# EAGLE design untitled (EAGLE 9.6.2)
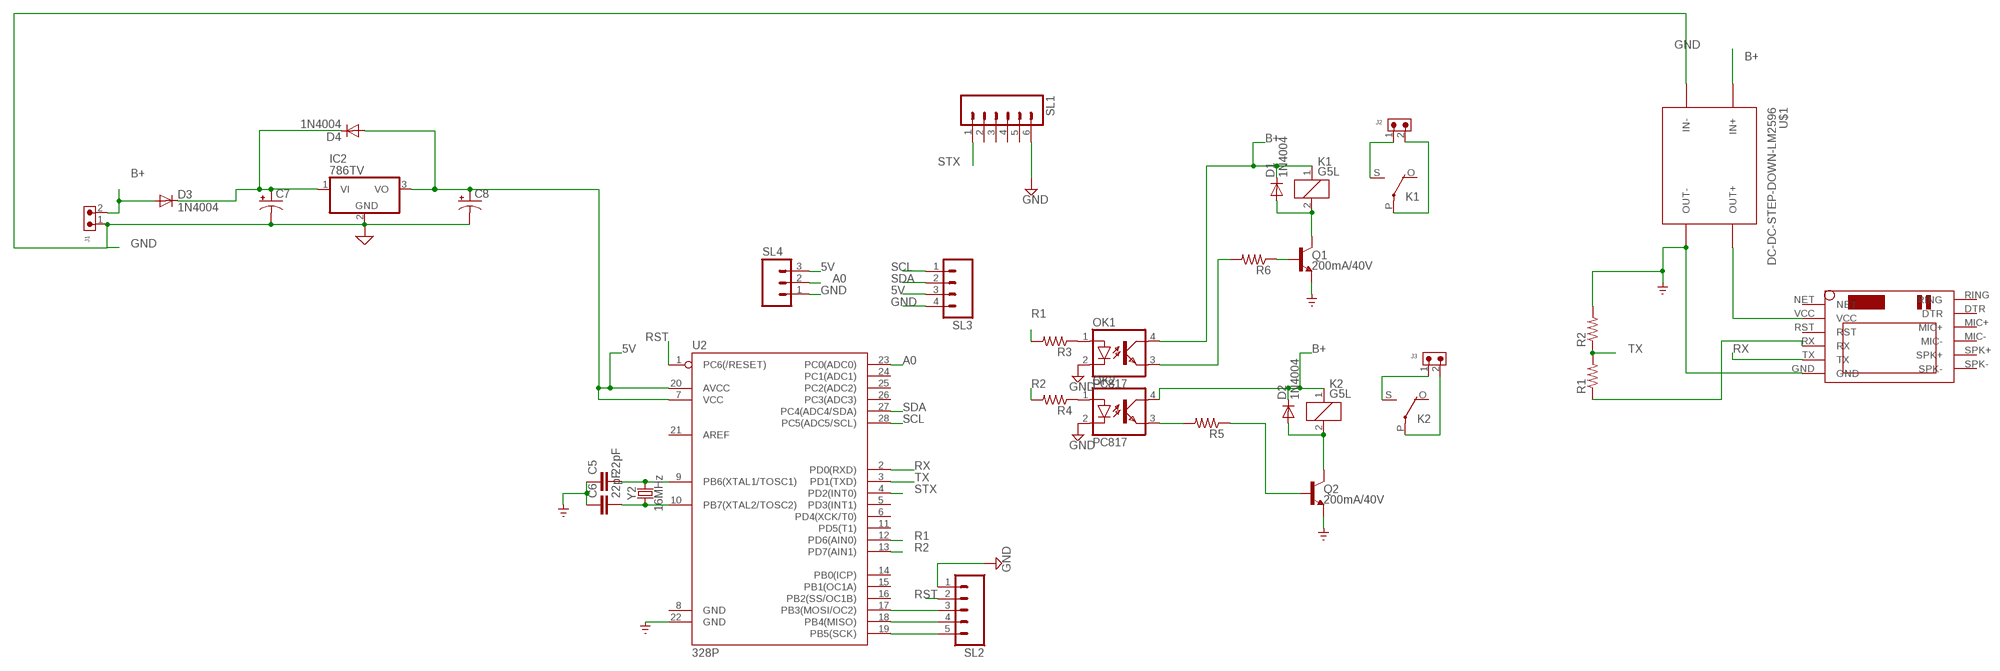
[diagram p0: schematic, sheet 1]

## Parts
C5  22pF  22PF-PTH-2.54MM-200V-5%  [CAP-PTH-2.54]
C6  22pF  22PF-PTH-2.54MM-200V-5%  [CAP-PTH-2.54]
C7  CAPACITOR-PE5-10.5  [E5-10,5]
C8  CAPACITOR-PE5-6  [E5-6]
D1  1N4004  [DO41-10]
D2  1N4004  [DO41-10]
D3  1N4004  [DO41-10]
D4  1N4004  [DO41-10]
IC2  786TV  [TO220V]
J1  691305530002  [691305530002]
J2  691305530002  [691305530002]
J3  691305530002  [691305530002]
K1  G5L  [G5LE]
K2  G5L  [G5LE]
OK1  PC817  [DIL04]
OK2  PC817  [DIL04]
Q1  200mA/40V  TRANS_NPN-2N3904  [TO-92]
Q2  200mA/40V  TRANS_NPN-2N3904  [TO-92]
R1  R-US_0207/9  [0207/9]
R2  R-US_0207/9  [0207/9]
R3  R-US_0207/9  [0207/9]
R4  R-US_0207/9  [0207/9]
R5  R-US_0207/9  [0207/9]
R6  R-US_0207/9  [0207/9]
SL1  M06  [06P]
SL2  M05  [05P]
SL3  M04  [04P]
SL4  M03  [03P]
U2  328P  ATMEGA328P_PDIP  [DIP28]
U$1  DC-DC-STEP-DOWN-LM2596  [DC-DC-STEP-DOWN-LM2596]
U$2  SIM800LMODULE  [SIM800LMODULE]
Y2  16MHz  CRYSTAL-16MHZPTH-HC49US  [HC49US]

## Nets
5V: C8.+ D4.A IC2.3(VO) SL3.3 SL4.3 U2.7(VCC) U2.20(AVCC)
A0: SL4.2 U2.23(PC0(ADC0))
B+: D1.C D2.C D3.A J1.2 K1.1 K2.1 OK1.4(COL) OK2.4(COL) U$1.IN+
GND: C5.1 C6.1 C7.- C8.- IC2.2(GND) J1.1 OK1.2(C) OK2.2(C) Q1.1(E) Q2.1(E) R2.2 SL1.6 SL2.1 SL3.4 SL4.1 U2.22(GND) U$1.IN- U$1.OUT- U$2.GND ; supply symbol labelled SUPPLY_BRASTAN_GND_, SUP
N$1: U$1.OUT+ U$2.VCC
N$2: R1.1 U$2.RX
N$3: OK1.1(A) R3.1
N$4: OK2.1(A) R4.1
N$5: SL2.5 U2.19(PB5(SCK))
N$6: SL2.4 U2.18(PB4(MISO))
N$7: SL2.3 U2.17(PB3(MOSI/OC2))
N$8: J3.1 K2.S(2:S)
N$9: J3.2 K2.P(2:P)
N$10: J2.1 K1.S(2:S)
N$11: C7.+ D3.C D4.C IC2.1(VI)
N$12: C6.2 U2.10(PB7(XTAL2/TOSC2)) Y2.1
N$13: C5.2 U2.9(PB6(XTAL1/TOSC1)) Y2.2
N$14: J2.2 K1.P(2:P)
N$17: D1.A K1.2 Q1.3(C)
N$19: D2.A K2.2 Q2.3(C)
N$21: OK1.3(EMIT) R6.2
N$22: Q1.2(B) R6.1
N$23: OK2.3(EMIT) R5.2
N$24: Q2.2(B) R5.1
R1: R3.2 U2.12(PD6(AIN0))
R2: R4.2 U2.13(PD7(AIN1))
RST: SL2.2 U2.1(PC6(/RESET))
RX: U2.2(PD0(RXD)) U$2.TX
SCL: SL3.1 U2.28(PC5(ADC5/SCL))
SDA: SL3.2 U2.27(PC4(ADC4/SDA))
STX: SL1.1 U2.4(PD2(INT0))
TX: R1.2 R2.1 U2.3(PD1(TXD))
Unconnected: K1.O(2:O) K2.O(2:O) SL1.2 SL1.3 SL1.4 SL1.5 U2.5(PD3(INT1)) U2.6(PD4(XCK/T0)) U2.8(GND) U2.11(PD5(T1)) U2.14(PB0(ICP)) U2.15(PB1(OC1A)) U2.16(PB2(SS/OC1B)) U2.21(AREF) U2.24(PC1(ADC1)) U2.25(PC2(ADC2)) U2.26(PC3(ADC3)) U$2.DTR U$2.MIC+ U$2.MIC- U$2.NET U$2.RING U$2.RST U$2.SPK+ U$2.SPK-

## Library data of the parts
C5 C6 = SparkFun-Capacitors:22PF: 22pF ceramic capacitors A capacitor is a passive two-terminal electrical component used to store electrical energy temporarily in an electric field.; PROD_ID: CAP-09128
C7 C8 = BeagleBone_Blue_R3:CAPACITOR-P: POLARIZED CAPACITOR, American symbol
D1-D4 = adafruit:1N4004: DIODE General purpose 1N400x type rectifier (With bigger pads) http://www.ladyada.net/library/pcb/eaglelibrary.html
IC2 = linear:78*: Positive VOLTAGE REGULATOR Source: http://cache.national.com/ds/LM/LM78L05.pdf http://www.fairchildsemi.com/ds/LM/LM7805.pdf
J1-J3 = Wurth_Connectors_WR-TBL Pluggable Connector:691305530002: WR-TBL Serie 3055 - 5,08 mm - PCB Header Vertical Entry with Plastic Latches KIND PROPERTIES Pitch 5.08 mm MATERIAL PROPERTIES Insulator Material PA66 Insulator Flammability Rating UL94 V-0 Insulator Color Green Terminal Material Copper Alloy Terminal Plating Tin-plated surface GENERAL INFORMATION Operating Temperature -40 up to +105 °C ELECTRICAL PROPERTIES IR UL 16 A Working Voltage [UL] 300 V (AC) Withstanding Voltage [UL] 2500 V (AC) Contact Resistance [UL] 20 mΩ CERTIFICATION UL Approval E315414 <https://www.we-online.com/catalog/media/o135349v209%20Family_WR-TBL3_6913055300xx.jpg> Details see: https://www.we-online.com/catalog/en/TBL_5_08_3055_6913055300XX/ Updated by Ella Wu 2019-12-30 2019(C) Wurth Elektronik; DATASHEET-URL: https://www.we-online.com/catalog/datasheet/691305530002.pdf; IR-UL: 16A; MOUNT: THT; PART-NUMBER: 691305530002; PINS: 2; PITCH: 5.08mm; TYPE: Vertical; WORKING-VOLTAGE-UL: 300V (AC)
K1 K2 = relay:G5L: RELAY 1 x switch, 10 A/120 V AC, 8 A/30 V ADC, Omron; OC_FARNELL: unknown; OC_NEWARK: unknown
OK1 OK2 = optocoupler:PC817: SHARP OPTO COUPLER; MPN: PC817X4J000F; OC_FARNELL: 9707727; OC_NEWARK: 97K7059
Q1 Q2 = SparkFun-DiscreteSemi:TRANS_NPN: NPN transistor Current controlled devices typically used to amplify current or used as a switch. BC547 - COM-08928 <http://www.sparkfun.com/products/8928> (TO-92 45V 100mA) (1.Collector 2.Base 3.Emitter) 2N3904 - COM-00521 <http://www.sparkfun.com/products/521> (TO-92 40V 200mA) (1.Emitter 2.Base 3.Collector) P2N2222A - COM-12852 <http://www.sparkfun.com/products/12852> (TO-92 40V 600mA) (1.Collector 2.Base 3.Emitter); PROD_ID: TRANS-08447
R1-R6 = adafruit:R-US_: RESISTOR, American symbol
SL1 = con-amp-quick:M06: AMP QUICK CONNECTOR; OC_FARNELL: unknown; OC_NEWARK: unknown
SL2 = con-amp-quick:M05: AMP QUICK CONNECTOR; OC_FARNELL: unknown; OC_NEWARK: unknown
SL3 = con-amp-quick:M04: AMP QUICK CONNECTOR; OC_FARNELL: unknown; OC_NEWARK: unknown
SL4 = con-amp-quick:M03: AMP QUICK CONNECTOR; OC_FARNELL: unknown; OC_NEWARK: unknown
U2 = SparkFun-IC-Microcontroller:ATMEGA328P_PDIP: Atmel 328P Through hole ATMEGA328P uC used in the Arduino 32kb flash, 1k EEPROM, 2k SRAM Datasheet <http://www.sparkfun.com/datasheets/Components/SMD/ATMega328.pdf> SparkFun Products Storefront component: AVR 28 Pin 20MHz 32K 6A/D - ATMega328P <https://www.sparkfun.com/products/9061> (COM-09061) SparkFun Simon Says - Through-Hole Soldering Kit <https://www.sparkfun.com/products/10547> (KIT-10547) SparkFun Learn to Solder - Simon Says <https://www.sparkfun.com/products/13708> (KIT-13708) SparkFun BigTime Watch Kit <https://www.sparkfun.com/products/11734> (KIT-11734) SparkFun ClockIt <https://www.sparkfun.com/products/10930> (KIT-10930) SparkFun Serial Enabled LCD Kit <https://www.sparkfun.com/products/10097> (LCD-10097) SparkFun Simon Tilts - Through Hole Soldering Kit <https://www.sparkfun.com/products/12634> (KIT-12634) SparkFun Frequency Counter Kit <https://www.sparkfun.com/products/10140> (KIT-10140) FabFM Radio Kit <https://www.sparkfun.com/products/11043> (KIT-11043) SparkFun Binary Blaster Kit <https://www.sparkfun.com/products/12037> (KIT-12037) SparkFun Metro-Gnome <https://www.sparkfun.com/products/9236> (KIT-09236) ATmega328 with Arduino Optiboot (Uno) <https://www.sparkfun.com/products/10524> (DEV-10524); PROD_ID: IC-09136
U$1 = diy-modules:DC-DC-STEP-DOWN-LM2596: DC/DC Step-Down Regulator based on LM2596-ADJ chip LM2596 datasheet available here: http://www.ti.com/lit/ds/symlink/lm2596.pdf Click here to find device on ebay.com <http://www.ebay.com/sch/lm2596+power+regulator>
U$2 = SIM800LMODULE:SIM800LMODULE: SIM800L Module
Y2 = SparkFun-Clocks:CRYSTAL-16MHZ: 16MHz Crystal Digikey Example <http://www.digikey.com/product-search/en?keywords=535-9122-1-ND> Frequency: 16MHz Frequency Stability: ±50ppm Frequency Tolerance: ±20ppm Load Capacitance: 18pF SparkFun Products: Pro Micro -5V/16MHz <https://www.sparkfun.com/products/12640> SparkFun Serial Enabled LCD Kit <https://www.sparkfun.com/products/10097>; PROD_ID: XTAL-08181; SF_ID: COM-00536

## Board
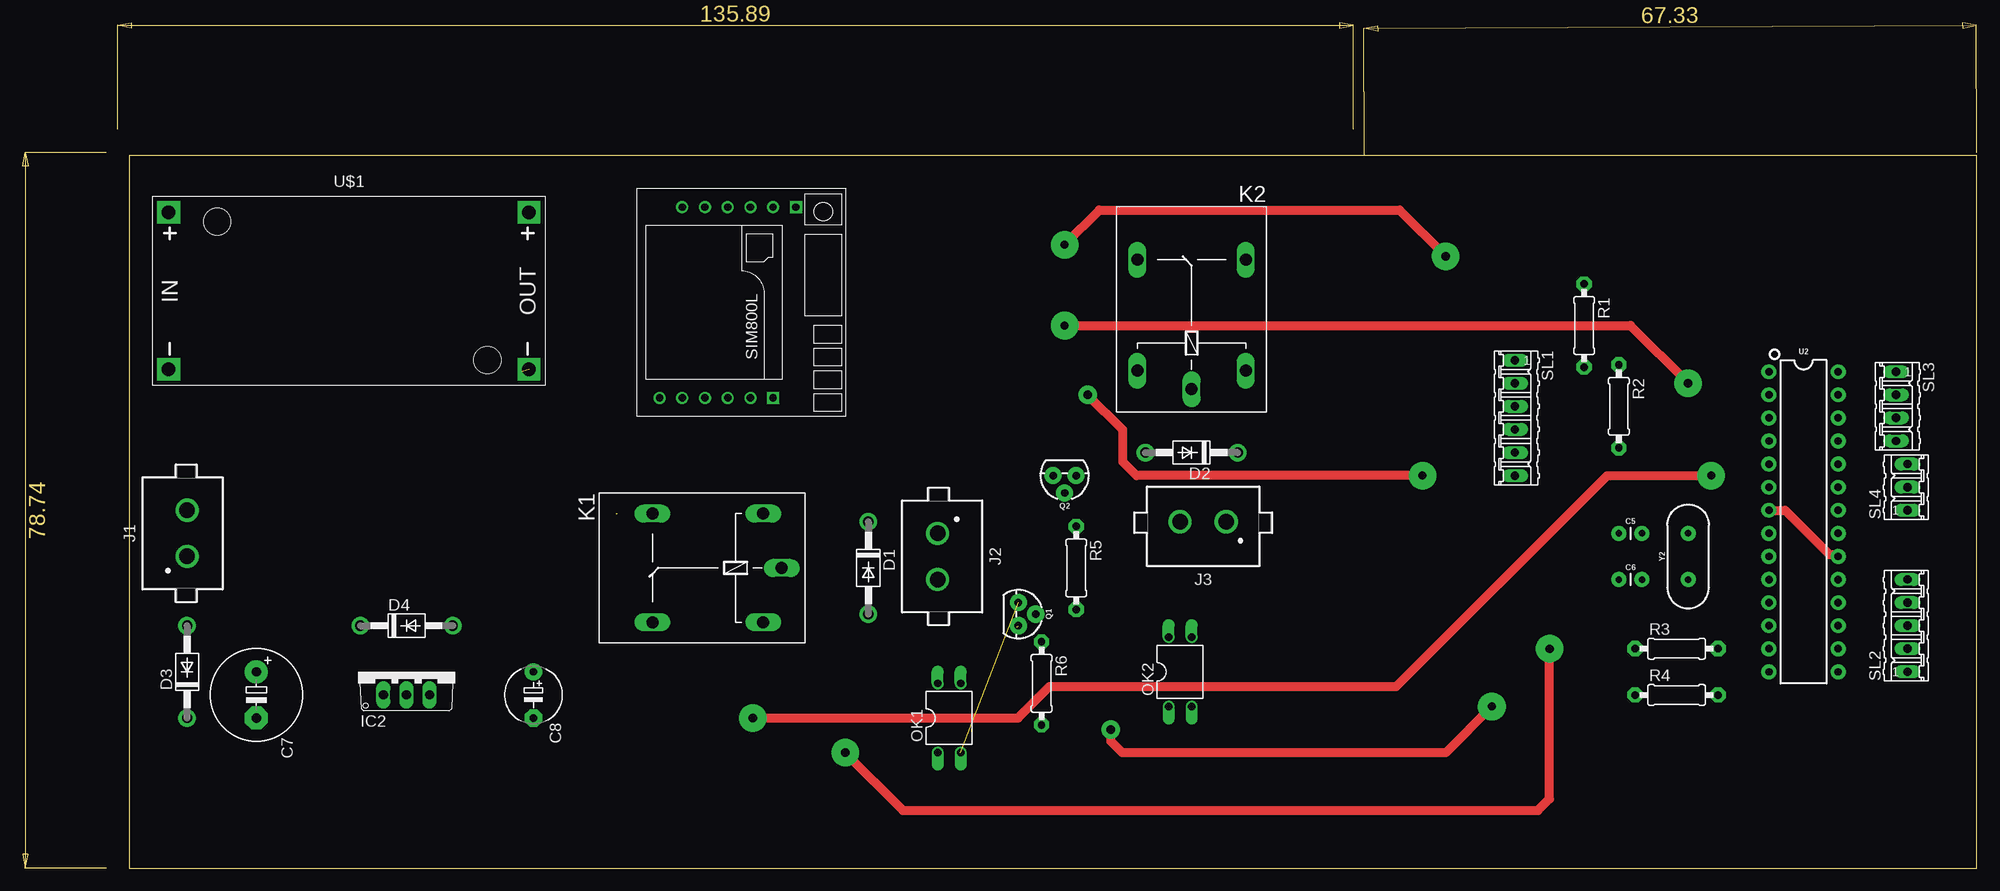
[diagram p1: board, top side]
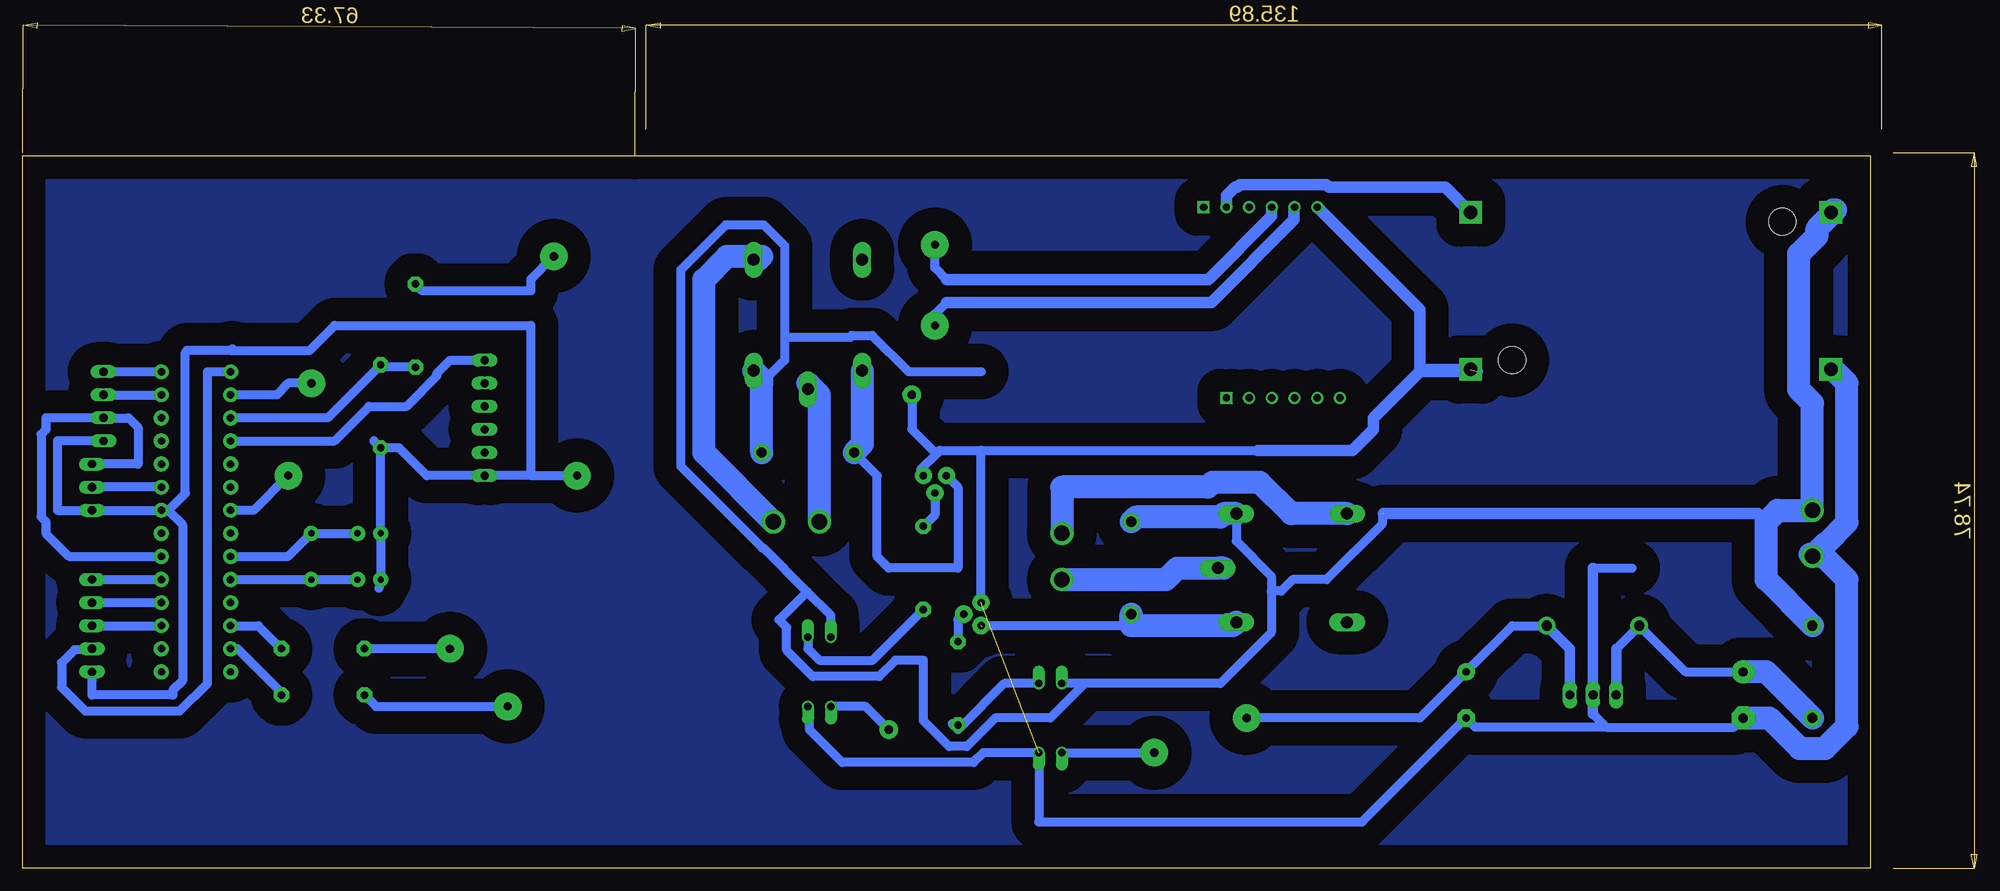
[diagram p2: board, bottom side, seen from below]

Size 203.18 x 78.41 mm. Coordinates in mm from the lower left corner, seen from the top.
Outline: 0,0 203.18,0 203.18,78.41 0,78.41 0,0
Copper layers (1*16): Top 0.035mm / dielectric 1.5mm / Bottom 0.035mm
Design rules "default *": minimum track width 40mil, minimum drill 0.35mm, track to track 30mil, track to pad 40mil, pad to pad 6mil, via to via 6mil, smd to smd 6mil, copper to edge 40mil, drill to drill 6mil, minimum pad ring 10mil, minimum via ring 8mil, stop-mask expansion 4mil, vias tented up to drill 0mil, thermal gap 10mil

### Footprints (pad centres in the part's own frame; a part is rotated, then mirrored left to right if it is on the bottom)
CAP-PTH-2.54 = drill 0.7 pad 1.651: 1 -1.27,0; 2 1.27,0
E5-10,5 = drill 1.016 pad 2.54: + -2.54,0 | drill 1.016 pad 2.54 octagon: - 2.54,0
E5-6 = drill 0.813 pad 1.905: + -2.54,0 | drill 0.813 pad 1.905 octagon: - 2.54,0
DO41-10 = drill 1.118 pad 1.93: A 5.08,0; C -5.08,0
TO220V = drill 1.016 long: 1 -2.54,-2.54; 2 0,-2.54; 3 2.54,-2.54
691305530002 = drill 1.7: 1 -2.54,0; 2 2.54,0
G5LE = drill 1.321 long: 1 -7.493,-5.969; 2 -7.493,5.969; O 4.699,5.969; P -9.525,0; S 4.699,-5.969
DIL04 = drill 0.813 offset: 1 -1.27,-3.81; 2 1.27,-3.81; 3 1.27,3.81; 4 -1.27,3.81
TO-92 = drill 0.813 pad 1.88: 1 -1.27,0; 2 0,1.905; 3 1.27,0
0207/9 = drill 0.813 pad 1.676 octagon: 1 -4.572,0; 2 4.572,0
06P = drill 0.914 long: 1 -6.35,0; 2 -3.81,0; 3 -1.27,0; 4 1.27,0; 5 3.81,0; 6 6.35,0
05P = drill 0.914 long: 1 -5.08,0; 2 -2.54,0; 3 0,0; 4 2.54,0; 5 5.08,0
04P = drill 0.914 long: 1 -3.81,0; 2 -1.27,0; 3 1.27,0; 4 3.81,0
03P = drill 0.914 long: 1 -2.54,0; 2 0,0; 3 2.54,0
DIP28 = drill 0.813 pad 1.626: 1 -16.51,-3.81; 2 -13.97,-3.81; 3 -11.43,-3.81; 4 -8.89,-3.81; 5 -6.35,-3.81; 6 -3.81,-3.81; 7 -1.27,-3.81; 8 1.27,-3.81; 9 3.81,-3.81; 10 6.35,-3.81; 11 8.89,-3.81; 12 11.43,-3.81; 13 13.97,-3.81; 14 16.51,-3.81; 15 16.51,3.81; 16 13.97,3.81; 17 11.43,3.81; 18 8.89,3.81; 19 6.35,3.81; 20 3.81,3.81; 21 1.27,3.81; 22 -1.27,3.81; 23 -3.81,3.81; 24 -6.35,3.81; 25 -8.89,3.81; 26 -11.43,3.81; 27 -13.97,3.81; 28 -16.51,3.81
DC-DC-STEP-DOWN-LM2596 = drill 1.5 pad 2.5 square: IN+ -19.812,8.636; IN- -19.812,-8.636; OUT+ 19.812,8.636; OUT- 19.812,-8.636 | hole 3: -14.478,7.62; 15.24,-7.62
SIM800LMODULE = drill 0.8: DTR 10.5,1; GND -10.5,-6.5; MIC+ 10.5,-1.5; MIC- 10.5,-4; RST -10.5,1; RX -10.5,-1.5; SPK+ 10.5,-6.5; SPK- 10.5,-9; TX -10.5,-4; VCC -10.5,3.5 | drill 0.8 square: NET -10.5,6; RING 10.5,3.5
HC49US = drill 0.7 pad 1.651: 1 -2.54,0; 2 2.54,0

### Placement (x,y rotation side)
C5  165.1,36.83 0 top
C6  165.1,31.75 0 top
C7  13.97,19.05 270 top
C8  44.45,19.05 270 top
D1  81.28,33.02 270 top
D2  116.84,45.72 180 top
D3  6.35,21.59 90 top
D4  30.48,26.67 0 top
IC2  30.48,21.59 0 top
J1  6.35,36.83 90 top
J2  88.9,34.29 270 top
J3  118.11,38.1 180 top
K1  62.23,33.02 180 top
K2  116.84,62.23 90 top
OK1  90.17,16.51 0 top
OK2  115.57,21.59 0 top
Q1  97.79,27.94 270 top
Q2  102.87,43.18 180 top
R1  160.02,59.69 270 top
R2  163.83,50.8 270 top
R3  170.18,24.13 0 top
R4  170.18,19.05 0 top
R5  104.14,33.02 270 top
R6  100.33,20.32 270 top
SL1  152.4,49.53 270 top
SL2  195.58,26.67 90 top
SL3  194.31,50.8 270 top
SL4  195.58,41.91 90 top
U2  184.15,38.1 270 top
U$1  24.13,63.5 0 top
U$2  67.31,62.23 270 top
Y2  171.45,34.29 90 top

### Tracks (layer width: path | path; a pad name or v marks a point on that pad's centre or on a via)
5V  (via drill 0.9 pad 3.05)
  Top 1.016: v68.58,16.51 97.75,16.51 101.21,19.96 139.34,19.96 162.56,43.18 v173.99,43.18 | U2.20 187.76,34.49 186.99,34.49 182.12,39.37 U2.7
  Bottom 1.016: D4.A 39.37,26.67 C8.+ 49.53,16.51 v68.58,16.51 | 195.22,49.53 SL3.3 | SL3.3 191.57,49.53 190.5,48.46 190.5,44.45 SL4.3 | SL3.3 200.66,49.53 200.66,48.23 201.17,47.73 201.17,38.63 200.66,38.13 200.66,36.83 198.12,34.29 U2.20 | v173.99,43.18 177.8,39.37 U2.7
  Bottom 1.143: IC2.3 33.02,24.13 D4.A
A0
  Bottom 1.016: U2.23 SL4.2
B+  (1 unrouted)
  Bottom 1.016: OK2.4 114.3,27.79 116.92,30.4 | 116.92,30.4 121.73,35.22 121.84,35.22 130.81,44.18 130.81,65.82 125.84,70.79 121.69,70.79 119.38,68.48 119.38,58.42 | 119.38,58.42 119.38,55.88 121.92,53.34 | K1.1 69.72,35.96 65.86,32.1 65.86,30.48 | 65.86,30.48 65.86,25.94 71.48,20.32 86.36,20.32 | 86.36,20.32 OK1.4 | 53.67,39.04 53.67,37.87 59.79,31.75 63.5,31.75 64.77,30.48 65.86,30.48 | 97.79,54.61 105.77,54.61 109.76,58.6 111.99,58.6 112.16,58.42 119.38,58.42 | 86.36,20.32 90.17,16.51 96.23,16.51 99.35,13.39 101.31,13.39 104.14,16.22 104.14,22.86 107.21,22.86 108.99,21.08 116.31,21.08 119.18,23.95 119.18,26.47 120.02,27.31 116.92,30.4
  Bottom 1.27: 11.43,38.1 12.37,39.04 53.54,39.04
  Bottom 2.54: D2.C 121.92,53.34 121.92,53.85 K2.1 | K1.1 71.11,38.99 71.49,38.61 80.77,38.61 D1.C | D3.A 11.43,31.75 11.43,38.1 10.16,39.37 J1.2 6.35,51.15 7.86,52.66 7.86,67.56 5.87,69.55 5.87,70.33 3.81,72.39 4.06,72.39 U$1.IN+
GND  (via drill 0.9 pad 2.03, 0.9 pad 3.05)  (2 unrouted)
  Top 1.016: v105.41,52.07 109.27,48.21 109.27,44.69 110.78,43.18 v142.24,43.18
  Bottom 1.016: Q2.1 104.43,43.84 102.71,45.56 | 102.71,45.56 102.31,45.95 97.79,45.95 | 97.79,45.95 67.31,45.95 66.82,45.95 | 187.19,39.37 U2.22 SL4.1 199.39,39.37 199.39,46.99 SL3.4 | 187.19,39.37 185.32,41.24 185.32,56.74 185.12,56.95 180.34,56.95 | 187.19,39.37 | 187.19,39.37 185.62,37.8 185.62,20.62 186.69,19.56 186.69,19.05 195.58,19.05 SL2.1 | 164.02,30.78 164.02,31.56 C6.1 C5.1 R2.2 | R2.2 161.8,46.23 158.75,43.18 SL1.6 147.32,43.18 | R2.2 164.59,46.99 | 180.14,57.15 180.34,56.95 | 147.32,43.18 147.32,59.69 168.91,59.69 171.65,56.95 180.34,56.95 | 147.32,43.18 v142.24,43.18 | v105.41,52.07 105.41,48.26 102.71,45.56 | OK2.2 116.64,17.58 116.64,15.19 113.06,11.61 98.61,11.61 97.52,12.7 OK1.2 91.44,5.08 55.88,5.08 C8.- 43.43,15.49 28.99,15.49 | 28.99,15.49 30.48,16.98 | 28.99,15.49 14.99,15.49 C7.- | Q1.1 97.79,45.95 | 30.48,33.02 26.16,33.02
  Bottom 1.143: 30.48,33.02 IC2.2 30.48,16.98
  Bottom 1.27: U$2.GND 49.53,61.45 49.53,54.61 43.18,54.61 | U$1.OUT- 49.28,54.86 54.61,49.53 54.61,48.26 56.92,45.95 67.31,45.95
  Bottom 2.54: J1.1 6.6,34.54 | C7.- 11.09,16.51 7.74,13.16 4.96,13.16 2.54,15.58 2.54,31.75 5.08,34.29 J1.1 | J1.1 4.91,35.73 4.84,35.73 2.54,38.03 2.54,53.34 4.06,54.86 U$1.IN-
N$1
  Bottom 1.27: U$1.OUT+ 46.74,74.93 59.54,74.93 59.8,75.18 69.33,75.18 69.58,74.93 69.85,74.93 70.81,73.97 U$2.VCC
N$2  (via drill 0.9 pad 3.05)
  Top 1.016: v102.87,68.58 106.68,72.39 139.7,72.39 v144.78,67.31
  Bottom 1.016: 101.6,64.77 102.87,66.04 v102.87,68.58 | v144.78,67.31 147.32,64.77 147.32,63.5 159.26,63.5 R1.1
  Bottom 1.27: U$2.RX 65.86,72.68 65.86,71.72 72.8,64.77 101.6,64.77
N$3  (via drill 0.9 pad 3.05)
  Top 1.016: v78.74,12.7 85.09,6.35 154.94,6.35 156.21,7.62 v156.21,24.13
  Bottom 1.016: OK1.1 v78.74,12.7 | v156.21,24.13 R3.1
N$4  (via drill 0.9 pad 2.03, 0.9 pad 3.05)
  Top 1.016: v149.86,17.78 144.78,12.7 109.22,12.7 107.95,13.97 v107.95,15.24
  Bottom 1.016: R4.1 164.34,17.78 v149.86,17.78 | v107.95,15.24 110.49,17.78 OK2.1
N$5
  Bottom 1.016: SL2.5 U2.19
N$6
  Bottom 1.016: SL2.4 U2.18
N$7
  Bottom 1.016: SL2.3 U2.17
N$8
  Bottom 2.54: J3.1 128.27,45.72 128.27,64.77 125.73,67.31 121.92,67.31 122.3,66.93 K2.S
N$9
  Bottom 1.016: K2.P 116.52,53.02
  Bottom 2.54: J3.2 115.57,52.07 116.52,53.02 116.84,53.34
N$10
  Bottom 2.54: K1.S 63.67,38.99 67.12,42.44 72.32,42.44 72.86,41.91 88.9,41.91 J2.1
N$11
  Bottom 1.016: 27.94,24.13 D4.C 20.32,21.59 C7.+
  Bottom 1.143: IC2.1 27.94,24.13
  Bottom 2.54: D3.C 11.43,21.59 C7.+
N$12
  Bottom 1.016: C6.2 Y2.1 U2.10
N$13
  Bottom 1.016: C5.2 Y2.2 173.99,34.29 U2.9
N$14
  Bottom 2.54: J2.2 77.47,31.75 76.2,33.02 K1.P 71.12,33.02
N$15
  pour Bottom (isolate 2.54): 0,78.74 203.2,78.74 203.2,0 0,0
N$17  (1 unrouted)
  Bottom 1.016: 81.28,26.67 97.48,26.67 97.64,26.51
  Bottom 2.54: K1.2 70.1,26.67 81.28,26.67 D1.A
N$19
  Bottom 1.016: Q2.3 100.33,41.91 100.33,33.02 107.95,33.02 109.22,34.29 109.22,43.18 D2.A
  Bottom 2.54: K2.2 110.87,46.61 D2.A
N$21
  Bottom 1.016: OK1.3 95.25,20.32 100.01,15.56 | 100.01,15.56 100.33,15.24 100.97,15.88 | R6.2 100.33,15.88 100.01,15.56
N$22
  Bottom 1.016: Q1.2 100.33,27.31 R6.1
N$23
  Bottom 1.016: OK2.3 116.84,24.13 115.57,22.86 109.73,22.86 R5.2
N$24
  Bottom 1.016: Q2.2 102.87,38.86 R5.1
R1
  Bottom 1.016: U2.12 177.29,26.67 R3.2
R2
  Bottom 1.016: U2.13 179.57,24.13 174.75,19.31 R4.2
RST
  Bottom 1.016: SL2.2 195.68,24.03 197.5,24.03 198.93,22.6 198.93,19.89 196.32,17.27 185.95,17.27 182.88,20.35 182.88,54.61 U2.1
RX  (via drill 0.9 pad 3.05)
  Top 1.016: v102.87,59.69 165.1,59.69 v171.45,53.34
  Bottom 1.016: 101.6,62.23 102.87,60.96 v102.87,59.69 | v171.45,53.34 173.99,53.34 175.26,52.07 U2.2
  Bottom 1.27: U$2.TX 63.36,72.68 63.36,71.34 72.47,62.23 101.6,62.23
SCL
  Bottom 1.016: SL3.1 U2.28
SDA
  Bottom 1.016: SL3.2 U2.27
STX
  Bottom 1.016: U2.4 168.91,46.99 165.1,50.8 161,50.8 157.66,54.14 157.66,54.43 156.21,55.88 SL1.1
TX
  Bottom 1.016: R1.2 163.58,55.12 R2.1 169.67,49.53 U2.3